# EAGLE design ko_relay (EAGLE 7.2.0)
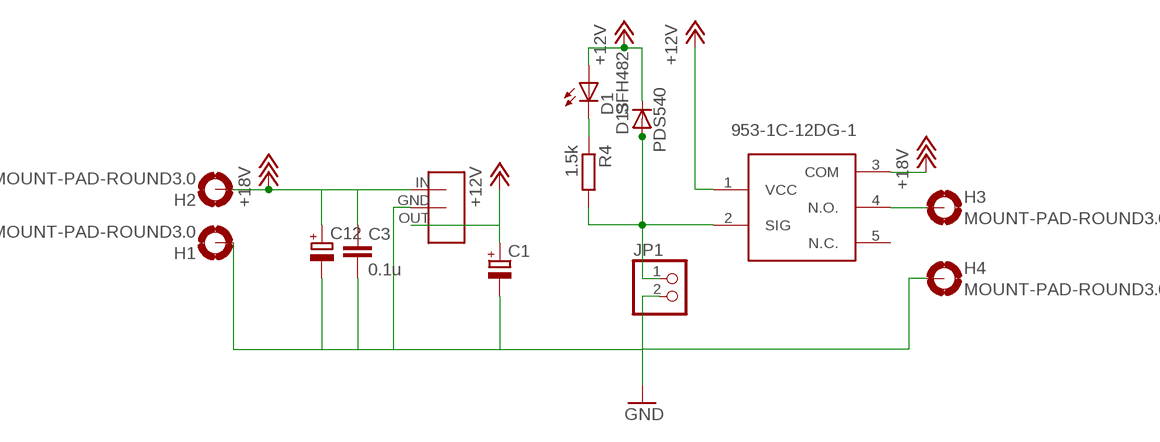
[diagram p0: schematic, sheet 1]

## Parts
C1  CPOL-EUE2.5-6  [E2,5-6]
C3  0.1u  C-EUC0603K  [C0603K]
C12  CPOL-EUE2.5-6  [E2,5-6]
D1  SFH482  [SFH482]
D13  PDS540  [POWER_DI_5]
H1  MOUNT-PAD-ROUND3.0  [3,0-PAD]
H2  MOUNT-PAD-ROUND3.0  [3,0-PAD]
H3  MOUNT-PAD-ROUND3.0  [3,0-PAD]
H4  MOUNT-PAD-ROUND3.0  [3,0-PAD]
JP1  PINHD-1X2  [1X02]
R4  1.5k  R-EU_R0603  [R0603]
U$1  HOGE  [HOGE]
U$8  RELAY(953-1C-12DG-1)  [953-1C-12DG-1]

## Nets
+12V: C1.+ D1.A D13.K(C) U$1.OUT U$8.1(VCC)
+18V: C3.1 C12.+ H2.B3,0(MOUNT) U$1.IN U$8.3(COM)
GND: C1.- C3.2 C12.- H1.B3,0(MOUNT) H4.B3,0(MOUNT) JP1.2 U$1.GND
N$5: H3.B3,0(MOUNT) U$8.4(N.O.)
N$9: D13.A1 D13.A2(A) JP1.1 R4.2 U$8.2(SIG)
N$11: D1.K(C) R4.1
Unconnected: U$8.5(N.C.)

## Library data of the parts
C1 C12 = rcl:CPOL-EU: POLARIZED CAPACITOR, European symbol
C3 = resistor:C-EU: CAPACITOR, European symbol
D1 = led:SFH482: IR LED infrared emitting diode, Infineon
D13 = Diode:PDS540
H1-H4 = holes:MOUNT-PAD-ROUND: MOUNTING PAD, round
JP1 = pinhead:PINHD-1X2: PIN HEADER
R4 = rcl:R-EU_: RESISTOR, European symbol
U$1 = HOGE:HOGE
U$8 = relay(953-1C-12DG-1):RELAY(953-1C-12DG-1)

## Board
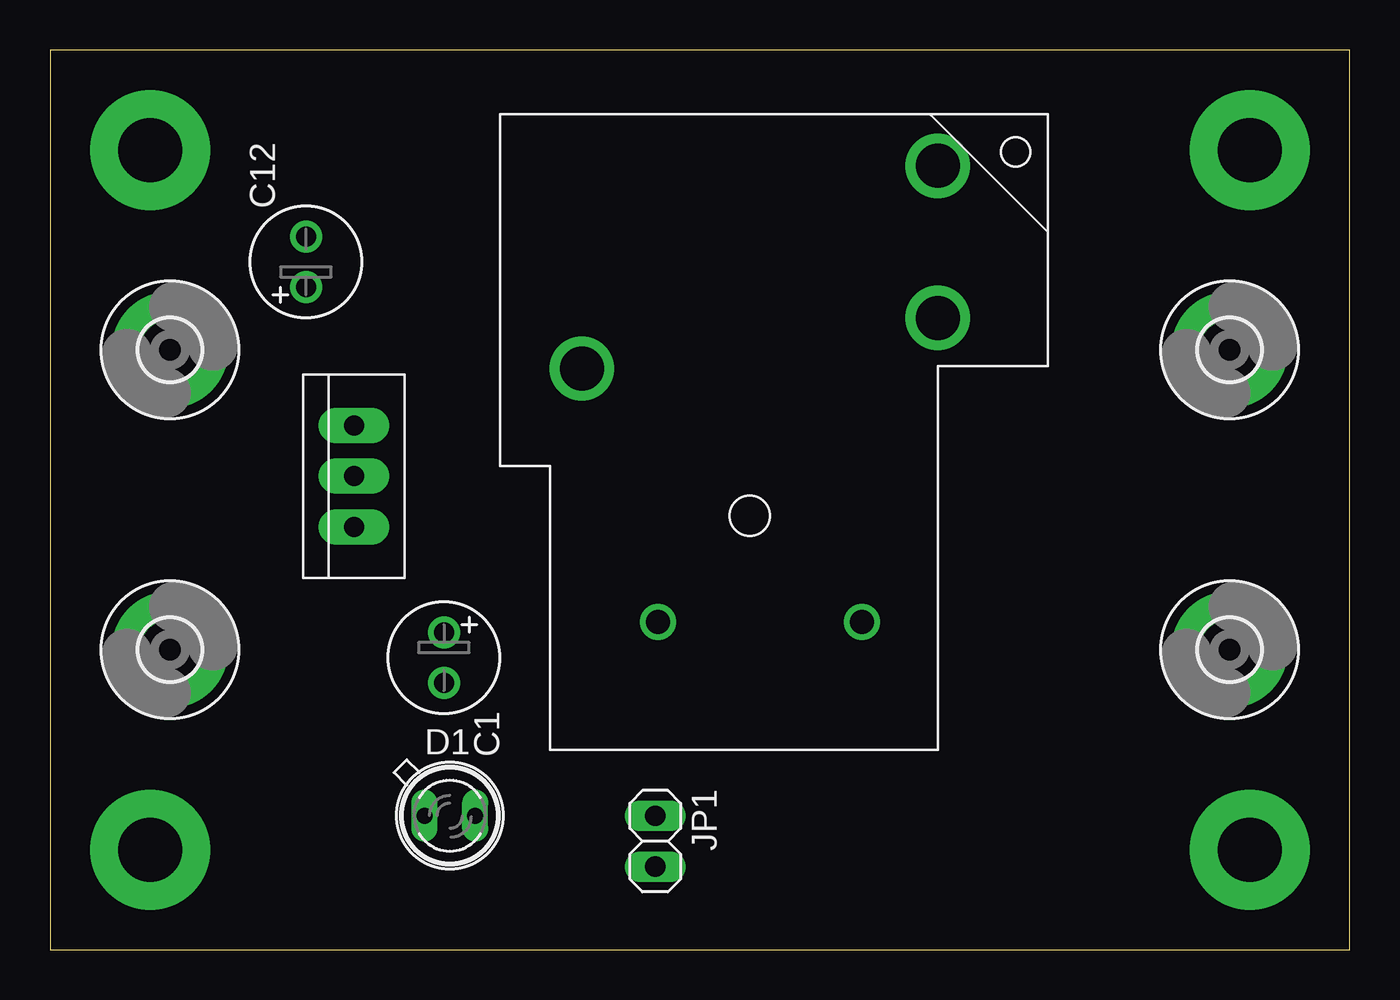
[diagram p1: board, top side]
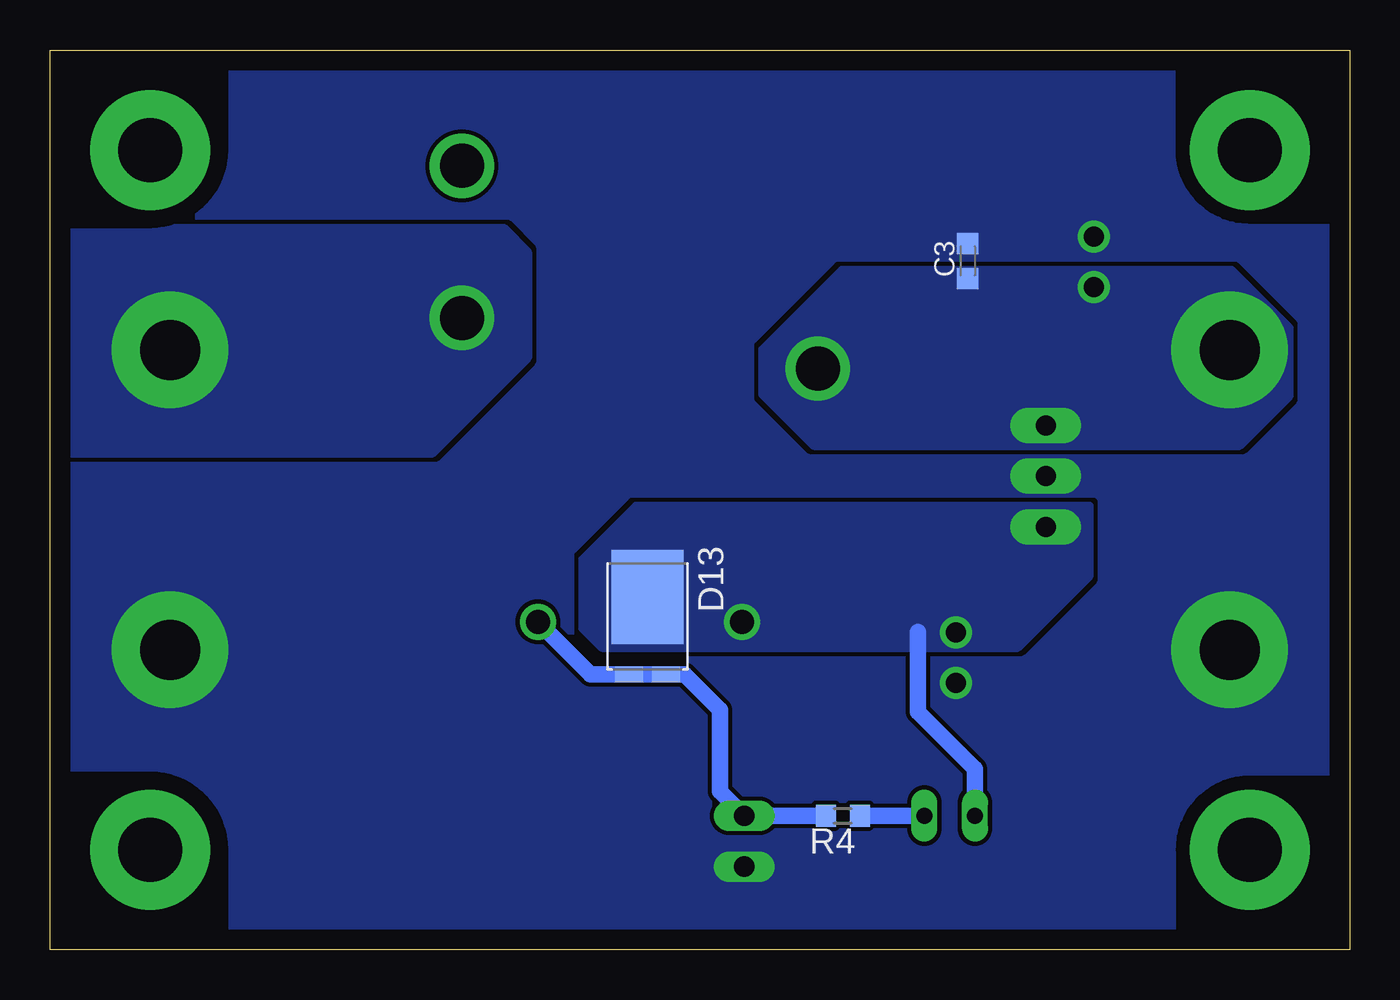
[diagram p2: board, bottom side, seen from below]

Size 65 x 45 mm. Coordinates in mm from the lower left corner, seen from the top.
Outline: 0,0 65,0 65,45 0,45 0,0
Copper layers (1*16): Top 0.035mm / dielectric 1.5mm / Bottom 0.035mm
Design rules "default": minimum track width 10mil, minimum drill 24mil, track to track 8mil, track to pad 8mil, pad to pad 8mil, via to via 8mil, smd to smd 8mil, copper to edge 40mil, drill to drill 8mil, minimum pad ring 10mil, minimum via ring 8mil, stop-mask expansion 4mil, vias tented up to drill 0mil, thermal gap 10mil
bRestrict: 12 lines

### Footprints (pad centres in the part's own frame; a part is rotated, then mirrored left to right if it is on the bottom)
E2,5-6 = drill 1 pad 1.6: + -1.27,0; - 1.27,0
C0603K = smd 1.05 x 1.08: 1 -0.875,0; 2 0.875,0
SFH482 = drill 0.8 long: A -1.27,0; K 1.27,0
POWER_DI_5 = smd 0.8 x 1.4: A1 3.87,0.92; A2 3.87,-0.92 | smd 4.7 x 3.6: K 0,0
3,0-PAD = drill 3 pad 5.842: B3,0 0,0
1X02 = drill 1.016 long: 1 -1.27,0; 2 1.27,0
R0603 = smd 1 x 1.1: 1 -0.85,0; 2 0.85,0
HOGE = drill 1 pad 1.778 long: GND 0,0; IN 0,2.54; OUT 0,-2.54
953-1C-12DG-1 = drill 1.2: 1 5.4,6.4; 2 15.6,6.4 | drill 2.2: 3 1.6,19.06; 4 19.4,21.6; 5 19.4,29.2

### Placement (x,y rotation side)
C1  19.7,14.6 270 top
C3  19.1,34.44 90 bottom
C12  12.8,34.4 90 top
D1  20,6.7 0 top
D13  35.11,17.63 270 bottom
H1  59,15 0 top
H2  6,30 0 top
H3  59,30 0 top
H4  6,15 0 top
JP1  30.27,5.42 270 top
R4  25.35,6.69 180 bottom
U$1  15.2,23.68 0 top
U$8  25,10 0 top

### Tracks (layer width: path | path; a pad name or v marks a point on that pad's centre or on a via)
+12V
  Bottom 0.813: D1.A 18.73,9.03 21.6,11.9 21.6,15.9
  pour Bottom (no thermals): 13,22.2 35.7,22.2 38.4,19.5 38.4,16.1 37.4,15.1 16.6,15.1 13,18.7
+18V
  pour Bottom (no thermals): 5.9,34 25.4,34 29.4,30 29.4,27.8 27.5,25.9 26.8,25.2 7.1,25.2 5.5,25.2 3,27.7 3,31.1
GND
  pour Bottom (rank 6, no thermals): -5.08,48.26 82.55,48.26 82.55,-7.62 -5.08,-7.62
N$1  (via drill 3.2 pad 6)
  other vias: 5,5
N$2  (via drill 3.2 pad 6)
  other vias: 60,5
N$3  (via drill 3.2 pad 6)
  other vias: 60,40
N$4  (via drill 3.2 pad 6)
  other vias: 5,40
N$5
  pour Bottom (no thermals): 42.3,36.1 41.1,34.9 41.1,29.6 45.9,24.8 68.7,24.8 68.7,36.1
N$9
  Bottom 0.813: U$8.2 37.96,13.76 D13.A2 D13.A1 33.26,13.76 31.5,12 31.5,7.92 JP1.1 R4.2
N$11
  Bottom 0.813: R4.1 D1.K